# Altium schematic sheet Display_Hour.SchDoc
size A; SheetNumber: 2; SheetTotal: 3
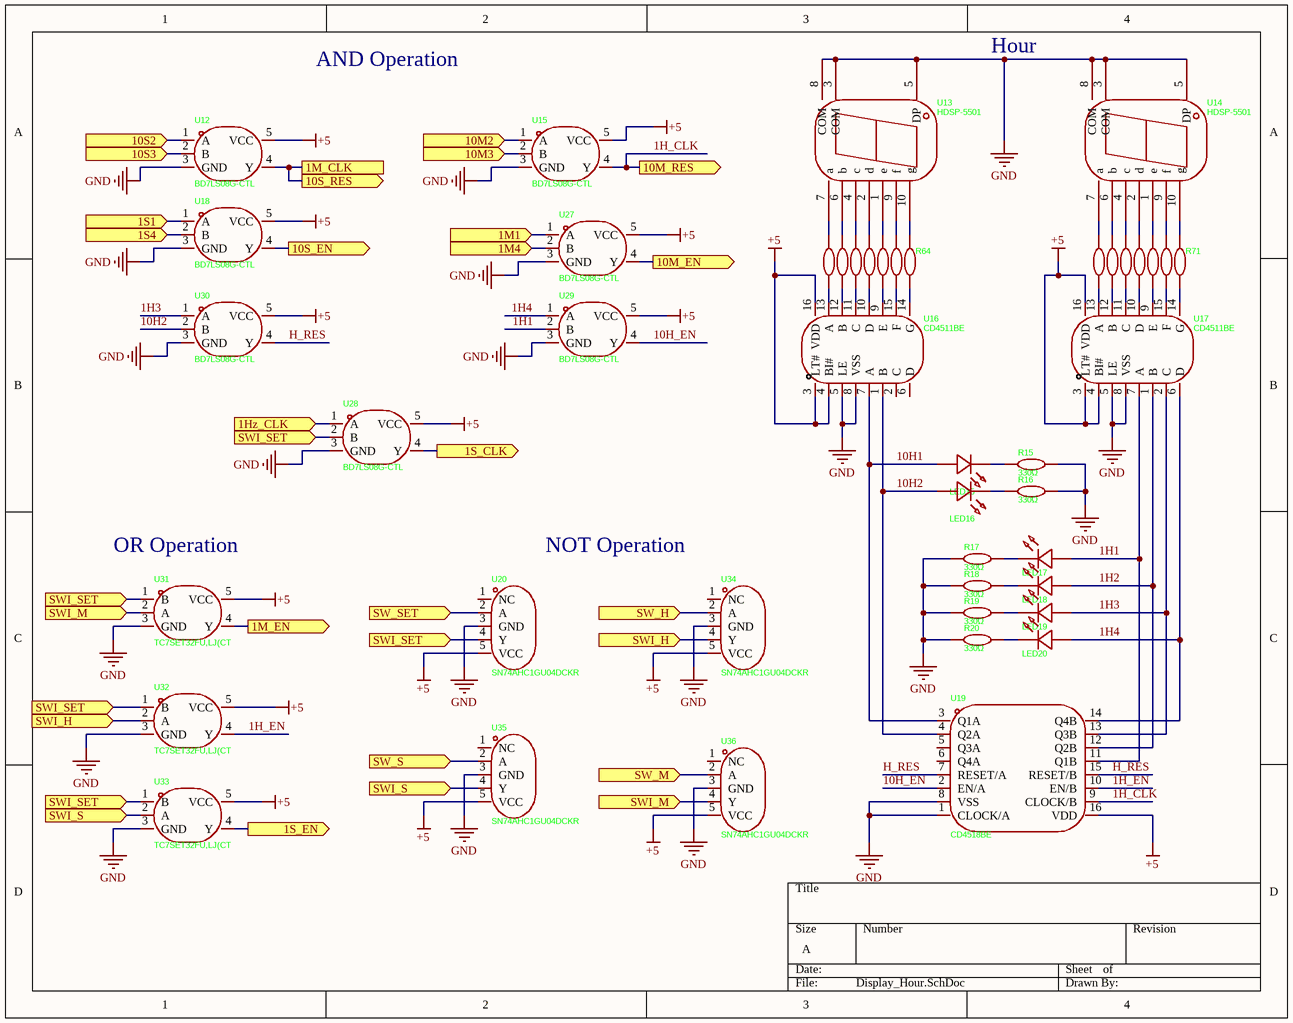
[diagram p0: Display_Hour.SchDoc]

## Parts
LED15  WP7113ID  [LED-TH_BD5.0-P2.54-FD]  (value not drawn)
LED16  WP7113ID  [LED-TH_BD5.0-P2.54-FD]  (value not drawn)
LED17  WP7113ID  [LED-TH_BD5.0-P2.54-FD]  (value not drawn)
LED18  WP7113ID  [LED-TH_BD5.0-P2.54-FD]  (value not drawn)
LED19  WP7113ID  [LED-TH_BD5.0-P2.54-FD]  (value not drawn)
LED20  WP7113ID  [LED-TH_BD5.0-P2.54-FD]  (value not drawn)
R15  330Ω  [RES-TH_BD2.3-L6.5-P10.50-D0.5]
R16  330Ω  [RES-TH_BD2.3-L6.5-P10.50-D0.5]
R17  330Ω  [RES-TH_BD2.3-L6.5-P10.50-D0.5]
R18  330Ω  [RES-TH_BD2.3-L6.5-P10.50-D0.5]
R19  330Ω  [RES-TH_BD2.3-L6.5-P10.50-D0.5]
R20  330Ω  [RES-TH_BD2.3-L6.5-P10.50-D0.5]
R58  330Ω  [RES-TH_BD2.3-L6.5-P10.50-D0.5]  (value not drawn)
R59  330Ω  [RES-TH_BD2.3-L6.5-P10.50-D0.5]  (value not drawn)
R60  330Ω  [RES-TH_BD2.3-L6.5-P10.50-D0.5]  (value not drawn)
R61  330Ω  [RES-TH_BD2.3-L6.5-P10.50-D0.5]  (value not drawn)
R62  330Ω  [RES-TH_BD2.3-L6.5-P10.50-D0.5]  (value not drawn)
R63  330Ω  [RES-TH_BD2.3-L6.5-P10.50-D0.5]  (value not drawn)
R64  330Ω  [RES-TH_BD2.3-L6.5-P10.50-D0.5]  (value not drawn)
R65  330Ω  [RES-TH_BD2.3-L6.5-P10.50-D0.5]  (value not drawn)
R66  330Ω  [RES-TH_BD2.3-L6.5-P10.50-D0.5]  (value not drawn)
R67  330Ω  [RES-TH_BD2.3-L6.5-P10.50-D0.5]  (value not drawn)
R68  330Ω  [RES-TH_BD2.3-L6.5-P10.50-D0.5]  (value not drawn)
R69  330Ω  [RES-TH_BD2.3-L6.5-P10.50-D0.5]  (value not drawn)
R70  330Ω  [RES-TH_BD2.3-L6.5-P10.50-D0.5]  (value not drawn)
R71  330Ω  [RES-TH_BD2.3-L6.5-P10.50-D0.5]  (value not drawn)
U12  BD7LS08G-CTL  [SSOP-5_L3.0-W1.6-P0.95-LS2.8-BR]
U13  HDSP-5501  [LED-SEG-TH_HDSP-A]
U14  HDSP-5501  [LED-SEG-TH_HDSP-A]
U15  BD7LS08G-CTL  [SSOP-5_L3.0-W1.6-P0.95-LS2.8-BR]
U16  CD4511BE  [DIP-16_L19.8-W6.5-P2.54-LS7.6-BL]
U17  CD4511BE  [DIP-16_L19.8-W6.5-P2.54-LS7.6-BL]
U18  BD7LS08G-CTL  [SSOP-5_L3.0-W1.6-P0.95-LS2.8-BR]
U19  CD4518BE  [DIP-16_L19.3-W6.4-P2.54-LS7.6-BL]
U20  SN74AHC1GU04DCKR  [SOT-353_L2.1-W1.3-P0.65-LS2.3-BR]
U27  BD7LS08G-CTL  [SSOP-5_L3.0-W1.6-P0.95-LS2.8-BR]
U28  BD7LS08G-CTL  [SSOP-5_L3.0-W1.6-P0.95-LS2.8-BR]
U29  BD7LS08G-CTL  [SSOP-5_L3.0-W1.6-P0.95-LS2.8-BR]
U30  BD7LS08G-CTL  [SSOP-5_L3.0-W1.6-P0.95-LS2.8-BR]
U31  TC7SET32FU,LJ(CT  [TSSOP-5_L2.0-W1.3-P0.65-LS2.1-BR]
U32  TC7SET32FU,LJ(CT  [TSSOP-5_L2.0-W1.3-P0.65-LS2.1-BR]
U33  TC7SET32FU,LJ(CT  [TSSOP-5_L2.0-W1.3-P0.65-LS2.1-BR]
U34  SN74AHC1GU04DCKR  [SOT-353_L2.1-W1.3-P0.65-LS2.3-BR]
U35  SN74AHC1GU04DCKR  [SOT-353_L2.1-W1.3-P0.65-LS2.3-BR]
U36  SN74AHC1GU04DCKR  [SOT-353_L2.1-W1.3-P0.65-LS2.3-BR]

## Ports
1Hz_CLK (in, see CLK_SW[4C]), 1M1 (in, see Display_SEC_MIN[2C]), 1M4 (in, see Display_SEC_MIN[2C]), 1M_CLK (see Display_SEC_MIN[2D]), 1M_EN (out, see Display_SEC_MIN[2D]), 1S1 (in, see Display_SEC_MIN[4C]), 1S4 (in, see Display_SEC_MIN[4C]), 1S_CLK (out, see Display_SEC_MIN[4D]), 1S_EN (out, see Display_SEC_MIN[4D]), 10M2 (in, see Display_SEC_MIN[1C]), 10M3 (in, see Display_SEC_MIN[1C]), 10M_EN (out, see Display_SEC_MIN[1D]), 10M_RES (out, see Display_SEC_MIN[1D]), 10S2 (in, see Display_SEC_MIN[3C]), 10S3 (in, see Display_SEC_MIN[3C]), 10S_EN (out, see Display_SEC_MIN[3D]), 10S_RES (out, see Display_SEC_MIN[3D]), SW_H (in, see CLK_SW[2C]), SW_M (in, see CLK_SW[2B]), SW_S (in, see CLK_SW[2A]), SW_SET (in, see CLK_SW[2D]), SWI_H (in, see Display_Hour[1C]), SWI_H (in, see Display_Hour[2C]), SWI_M (in, see Display_Hour[1C]), SWI_M (in, see Display_Hour[2D]), SWI_S (in, see Display_Hour[1D]), SWI_S (in, see Display_Hour[2D]), SWI_SET (in, see Display_Hour[1B], Display_Hour[1C], Display_Hour[1D]), SWI_SET (in, see Display_Hour[1B], Display_Hour[1C], Display_Hour[1D], Display_Hour[2C]), SWI_SET (in, see Display_Hour[1B], Display_Hour[1C], Display_Hour[2C]), SWI_SET (in, see Display_Hour[1C], Display_Hour[1D], Display_Hour[2C])

## Nets
+5: U12.5(VCC) U15.5(VCC) U16.3(LT#) U16.4(BI#) U16.16(VDD) U17.3(LT#) U17.4(BI#) U17.16(VDD) U18.5(VCC) U19.16(VDD) U20.5(VCC) U27.5(VCC) U28.5(VCC) U29.5(VCC) U30.5(VCC) U31.5(VCC) U32.5(VCC) U33.5(VCC) U34.5(VCC) U35.5(VCC) U36.5(VCC)
GND: R15.2 R16.2 R17.1 R18.1 R19.1 R20.1 U12.3(GND) U13.3(COM) U13.5(DP) U13.8(COM) U14.3(COM) U14.5(DP) U14.8(COM) U15.3(GND) U16.5(LE) U16.8(VSS) U17.5(LE) U17.8(VSS) U18.3(GND) U19.1(CLOCK/A) U19.8(VSS) U20.3(GND) U27.3(GND) U28.3(GND) U29.3(GND) U30.3(GND) U31.3(GND) U32.3(GND) U33.3(GND) U34.3(GND) U35.3(GND) U36.3(GND)
1H1: LED17.1(A) U17.7(A) U19.11(Q1B) U29.2(B)
1H2: LED18.1(A) U17.1(B) U19.12(Q2B)
1H3: LED19.1(A) U17.2(C) U19.13(Q3B) U30.1(A)
1H4: LED20.1(A) U17.6(D) U19.14(Q4B) U29.1(A)
1H_CLK: U15.4(Y) U19.9(CLOCK/B) ; port 10M_RES
1H_EN: U19.10(EN/B) U32.4(Y)
1Hz_CLK: U28.1(A) ; port 1Hz_CLK
1M1: U27.1(A) ; port 1M1
1M4: U27.2(B) ; port 1M4
1M_EN: U31.4(Y) ; port 1M_EN
1S1: U18.1(A) ; port 1S1
1S4: U18.2(B) ; port 1S4
1S_CLK: U28.4(Y) ; port 1S_CLK
1S_EN: U33.4(Y) ; port 1S_EN
10H1: LED15.1(A) U16.7(A) U19.3(Q1A)
10H2: LED16.1(A) U16.1(B) U19.4(Q2A) U30.2(B)
10H_EN: U19.2(EN/A) U29.4(Y)
10M2: U15.1(A) ; port 10M2
10M3: U15.2(B) ; port 10M3
10M_EN: U27.4(Y) ; port 10M_EN
10S2: U12.1(A) ; port 10S2
10S3: U12.2(B) ; port 10S3
10S_EN: U18.4(Y) ; port 10S_EN
10S_RES: U12.4(Y) ; port 10S_RES, port 1M_CLK
H_RES: U19.7(RESET/A) U19.15(RESET/B) U30.4(Y)
SW_H: U34.2(A) ; port SW_H
SW_M: U36.2(A) ; port SW_M
SW_S: U35.2(A) ; port SW_S
SW_SET: U20.2(A) ; port SW_SET
SWI_H: U32.2(A) U34.4(Y) ; port SWI_H
SWI_M: U31.2(A) U36.4(Y) ; port SWI_M
SWI_S: U33.2(A) U35.4(Y) ; port SWI_S
SWI_SET: U20.4(Y) U28.2(B) U31.1(B) U32.1(B) U33.1(B) ; port SWI_SET
NetLED15_2: LED15.2(K) R15.1
NetLED16_2: LED16.2(K) R16.1
NetLED17_2: LED17.2(K) R17.2
NetLED18_2: LED18.2(K) R18.2
NetLED19_2: LED19.2(K) R19.2
NetLED20_2: LED20.2(K) R20.2
NetR58_1: R58.1 U16.13(A)
NetR58_2: R58.2 U13.7(a)
NetR59_1: R59.1 U16.12(B)
NetR59_2: R59.2 U13.6(b)
NetR60_1: R60.1 U16.11(C)
NetR60_2: R60.2 U13.4(c)
NetR61_1: R61.1 U16.10(D)
NetR61_2: R61.2 U13.2(d)
NetR62_1: R62.1 U16.9(E)
NetR62_2: R62.2 U13.1(e)
NetR63_1: R63.1 U16.15(F)
NetR63_2: R63.2 U13.9(f)
NetR64_1: R64.1 U16.14(G)
NetR64_2: R64.2 U13.10(g)
NetR65_1: R65.1 U17.13(A)
NetR65_2: R65.2 U14.7(a)
NetR66_1: R66.1 U17.12(B)
NetR66_2: R66.2 U14.6(b)
NetR67_1: R67.1 U17.11(C)
NetR67_2: R67.2 U14.4(c)
NetR68_1: R68.1 U17.10(D)
NetR68_2: R68.2 U14.2(d)
NetR69_1: R69.1 U17.9(E)
NetR69_2: R69.2 U14.1(e)
NetR70_1: R70.1 U17.15(F)
NetR70_2: R70.2 U14.9(f)
NetR71_1: R71.1 U17.14(G)
NetR71_2: R71.2 U14.10(g)

Not connected (* = marked no-connect by the designer): U16 2(C) 6(D); U19 5(Q3A) 6(Q4A); U20 1(NC); U34 1(NC); U35 1(NC); U36 1(NC)

## Notes on the sheet
- AND Operation
- Hour
- (near U31) OR Operation
- NOT Operation

## Library data of the parts
LED15-LED20 = D_LED_2mm_red: Manufacturer: Kingbright; Add into BOM: yes; Emitted Color: Red; Forward Voltage (VF): 2V; Forward Current: 20mA; Dominant Wavelength: 617nm; Peak Wavelength: 627nm; Lens Color: Red Lens; Luminous Intensity: 40mcd; Viewing Angle: 30°; Symbol: WP7113ID; Device: WP7113ID; LCSC Part Name: WP7113ID; Supplier Part: C6926004; Manufacturer Part: WP7113ID; Supplier Footprint: 插件,D=5mm; JLCPCB Part Class: Extended Part; Datasheet: https://atta.szlcsc.com/upload/public/pdf/source/20241101/124CAE47E7911E6EBC0B1714F77DAFC6.pdf; Supplier: LCSC; Convert to PCB: yes
R15-R20 R58-R71 = Reg_330R_0.25W: Manufacturer: CCO(千志电子); Symbol: MF1/4W-330Ω±1% T52; Device: MF1/4W-330Ω±1% T; Add into BOM: yes; Tolerance: ±1%; Voltage-Supply(Max): 250V; Power(Watts): 250mW; Temperature Coefficient: ±100ppm/℃; LCSC Part Name: 330Ω ±1% 250mW 金属膜电阻; Supplier Part: C119313; Manufacturer Part: MF1/4W-330Ω±1% T; Supplier Footprint: 插件,D2.3xL6.5mm; JLCPCB Part Class: Extended Part; Datasheet: https://atta.szlcsc.com/upload/public/pdf/source/20190910/C427326_62A6D058BC0FF74963A2F22379CA06CE.pdf; Supplier: LCSC; Convert to PCB: yes; Type: Metal Film Resistors; Value: 330Ω; Operating Temperature: -55℃~+155℃
U12 U15 U18 U27-U30 = AND_BD7LS08G-CTL: Manufacturer: ROHM(罗姆); Add into BOM: yes; Logic Gate Type: 与门; Number of Channels: 1; Supply Voltage: 1.65V~5.5V; Quiescent Current (Max): 10uA; Sink Current: 32mA; Propagation Delay Time: 10ns@5V,50pF; Symbol: BD7LS08G-CTL; Device: BD7LS08G-CTL; LCSC Part Name: BD7LS08G-CTL; Supplier Part: C4471342; Manufacturer Part: BD7LS08G-CTL; Supplier Footprint: SSOP-5; JLCPCB Part Class: Extended Part; Supplier: LCSC; Convert to PCB: yes; Source Current: 32mA; Operating Temperature: -40℃~+125℃
U13 U14 = HDSP-5501: Manufacturer: Broadcom/AVAGO(安华高); Symbol: HDSP-5501_C18198807; Add into BOM: yes; Device: HDSP-5501_C18198807; LCSC Part Name: HDSP-5501; Supplier Part: C18198807; Manufacturer Part: HDSP-5501; Supplier Footprint: 插件; JLCPCB Part Class: Extended Part; Datasheet: https://atta.szlcsc.com/upload/public/pdf/source/20230925/D6197A9C41D1E502B523821274CC57EA.pdf; Supplier: LCSC; Convert to PCB: yes
U16 U17 = CD4511BE_C507153: Manufacturer: HGSEMI(华冠); Add into BOM: yes; Symbol: CD4511BE_C507153; Device: CD4511BE_C507153; LCSC Part Name: CMOS BCD 到 7 段 LED 锁存解码器驱动器; Supplier Part: C507153; Manufacturer Part: CD4511BE; Supplier Footprint: DIP-16; JLCPCB Part Class: Extended Part; Datasheet: https://atta.szlcsc.com/upload/public/pdf/source/20220513/69A3CD8936477BC6706446B8F2E34C07.pdf; Supplier: LCSC; Convert to PCB: yes
U19 = CD4518BE: Manufacturer: TI(德州仪器); Add into BOM: yes; Logic Type: BCDCounter; Direction: Rising Edge；Falling Edge; Voltage - Supply: 3V~18V; Number of Elements: 2; Reset: Asynchronous; Timing: Synchronous; Count Rate: 8MHz; Symbol: CD4518BE; Device: CD4518BE; LCSC Part Name: CD4518BE; Supplier Part: C5220; Manufacturer Part: CD4518BE; Supplier Footprint: DIP-16; JLCPCB Part Class: Extended Part; Datasheet: https://www.ti.com/cn/lit/gpn/cd4518b; Supplier: LCSC; Convert to PCB: yes; Operating Temperature: -55℃~+125℃
U20 U34-U36 = NOT_SN74AHC1GU04DCKR_C7472: Manufacturer: TI(德州仪器); Add into BOM: yes; Supply Voltage(Single): 2V~5.5V; Supply Current (Max): 1uA; Number of Circuits: 1; Sink Current: 8mA; High level range (VIH): 1.7V~4.4V; Low level range (VIL): 300mV~1.1V; Max Propagation Delay: 7ns@5V,50pF; Symbol: SN74AHC1GU04DCKR_C7472; Device: SN74AHC1GU04DCKR_C7472; LCSC Part Name: 单路反相器; Supplier Part: C7472; Manufacturer Part: SN74AHC1GU04DCKR; Supplier Footprint: SOT-353; JLCPCB Part Class: Extended Part; Datasheet: https://www.ti.com/cn/lit/gpn/sn74ahc1gu04; Supplier: LCSC; Convert to PCB: yes; Input Type: -; Number of Inputs: 1; Source Current: 8mA; Series: 74AHCSeries; Operating Temperature: -40℃~+85℃
U31-U33 = OR_GATE_TC7SET32FU,LJ(CT: Manufacturer: TOSHIBA(东芝); Add into BOM: yes; Logic Gate Type: ORGate; Number of Channels: 1; Supply Voltage: 4.5V~5.5V; Quiescent Current (Max): 2uA; Sink Current: 8mA; High Level Range (VIH): 2V; Low Level Range (VIL): 800mV; Propagation Delay Time: 9ns@5V,50pF; Symbol: TC7SET32FU,LJ(CT; Device: TC7SET32FU,LJ(CT; LCSC Part Name: TC7SET32FU,LJ(CT; Supplier Part: C7360615; Manufacturer Part: TC7SET32FU,LJ(CT; Supplier Footprint: SSOP-5; JLCPCB Part Class: Extended Part; Datasheet: https://atta.szlcsc.com/upload/public/pdf/source/231023/inline-d04b01c8ac5c233d4c0f3d416dbdd867.pdf; Supplier: LCSC; Convert to PCB: yes; Source Current: 8mA; Series: TC7SETSeries; Operating Temperature: -40℃~+85℃